# EAGLE design 1A_driver (EAGLE 7.7.0)
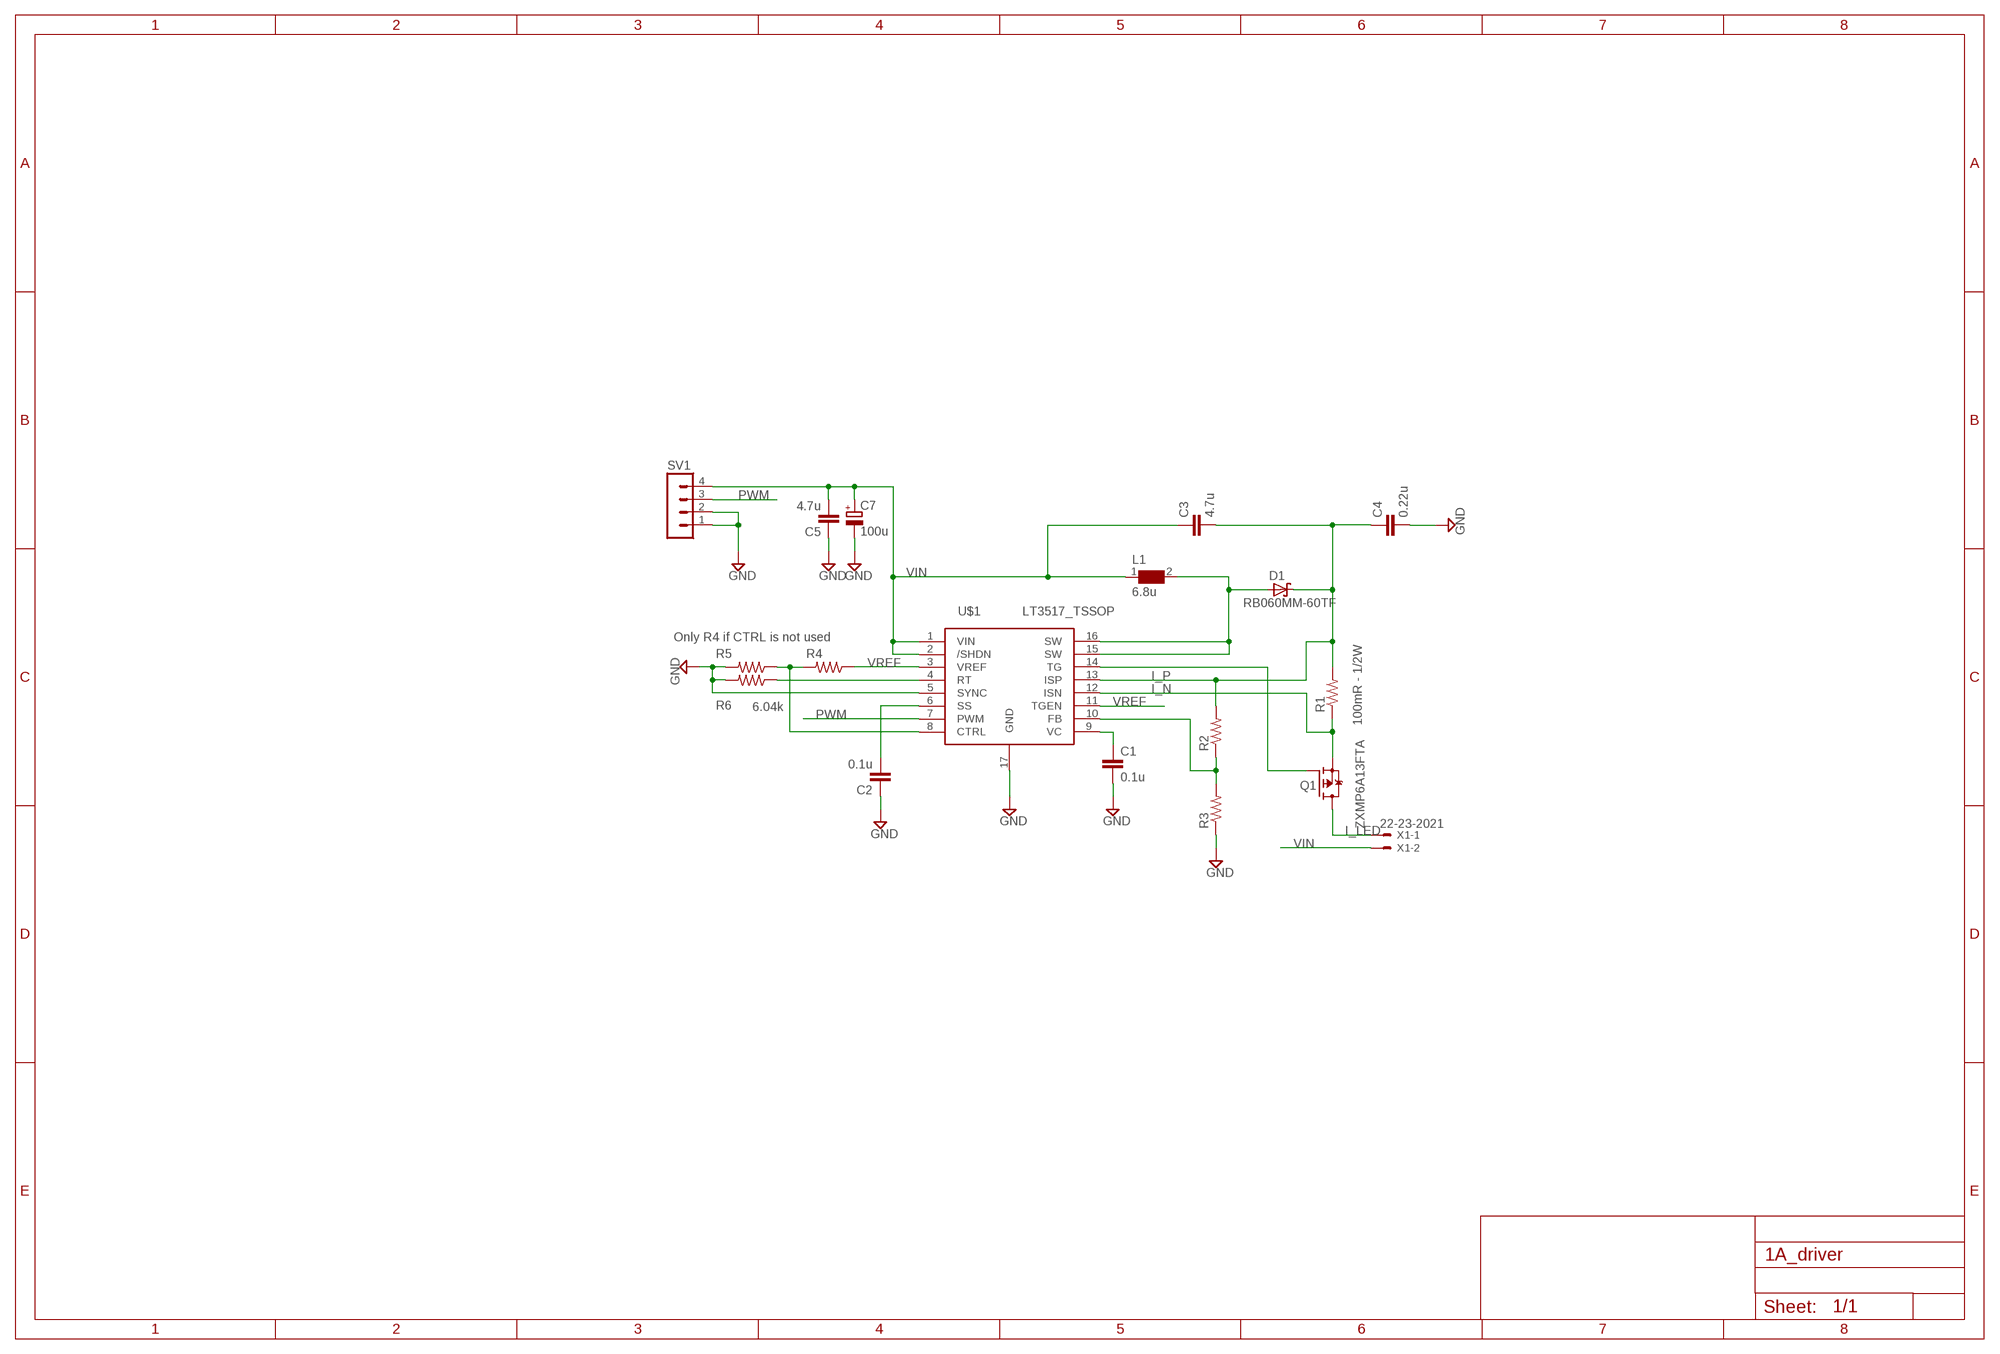
[diagram p0: schematic, sheet 1]

## Parts
C1  0.1u  CAP_0603  [R0603]
C2  0.1u  CAP_0603  [R0603]
C3  4.7u  CAP_1206  [R1206]
C4  0.22u  CAP_0603  [R0603]
C5  4.7u  CAP_1206  [R1206]
C7  100u  CPOL-EUE5-5  [E5-5]
D1  RB060MM-60TF  SCH_DIODE  [SOD123FL]
L1  6.8u  WE-PD-744771006_1260/1245/1280/1210  [WE-PD_1260/1245/1280/1210]
Q1  ZXMP6A13FTA  P-CHAN_MOSFET  [SOT23]
R1  100mR - 1/2W  RES_1206  [R1206]
R2  RES_0603  [R0603]
R3  RES_0603  [R0603]
R4  RES_0603  [R0603]
R5  RES_0603  [R0603]
R6  6.04k  RES_0603  [R0603]
SV1  MA04-1  [MA04-1]
U$1  LT3517_TSSOP  [TSSOP16_PAD]
X1  22-23-2021  [22-23-2021]

## Nets
GND: C1.2 C2.1 C4.2 C5.1 C7.- R3.1 R5.2 R6.2 SV1.1 SV1.2 U$1.5(SYNC) U$1.17(GND)
I_LED: Q1.D X1.1
I_N: Q1.S R1.1 U$1.12(ISN)
I_P: C3.2 C4.1 D1.C R1.2 R2.2 U$1.13(ISP)
N$3: Q1.G U$1.14(TG)
N$4: D1.A L1.2 U$1.15(SW) U$1.16(SW)
N$6: R2.1 R3.2 U$1.10(FB)
N$8: C2.2 U$1.6(SS)
N$9: R4.2 R5.1 U$1.8(CTRL)
N$10: C1.1 U$1.9(VC)
N$11: R6.1 U$1.4(RT)
PWM: SV1.3 U$1.7(PWM)
VIN: C3.1 C5.2 C7.+ L1.1 SV1.4 U$1.1(VIN) U$1.2(/SHDN) X1.2
VREF: R4.1 U$1.3(VREF) U$1.11(TGEN)

## Notes on the sheet
- Only R4 if CTRL is not used

## Library data of the parts
C1 C2 C4 = standard_passive:CAP_0603
C3 C5 = standard_passive:CAP_1206
C7 = rcl:CPOL-EU: POLARIZED CAPACITOR, European symbol
D1 = DIODES:SCH_DIODE
L1 = WE-PD:WE-PD: SMD-Shielded Power Inductors WE-PD - Magnetically shielded version which results in a low leakage field - High storage capacity - Low self-losses - Highest possible current loading for SMD-Inducors -- Switching regulators with low operating voltages (computer, laptop, mobile phones, pagers) -- Integrated DC/DC-converter -- Is recommended for the application with switching regulators from National Semiconductor, Linear Technology, Texas Instruments and Fairchild Semiconductor, ect. -- Graphic cards -- Plastic base: Because of the one piece construction these are more suitable for high vibration or shock applications; MPN: 744771006; OC_FARNELL: 2211534; OC_NEWARK: 44W4713; PACKAGE: 1260; SUPPLIER: Wuerth Elektronik
Q1 = MOSFET:P-CHAN_MOSFET
R1 = standard_passive:RES_1206
R2-R6 = standard_passive:RES_0603
SV1 = con-lstb:MA04-1: PIN HEADER; OC_FARNELL: unknown; OC_NEWARK: unknown
U$1 = LT3517:LT3517_TSSOP
X1 = con-molex:22-23-2021: .100" (2.54mm) Center Header - 2 Pin; MF: MOLEX; MPN: 22-23-2021; OC_FARNELL: 1462926; OC_NEWARK: 25C3832

## Board
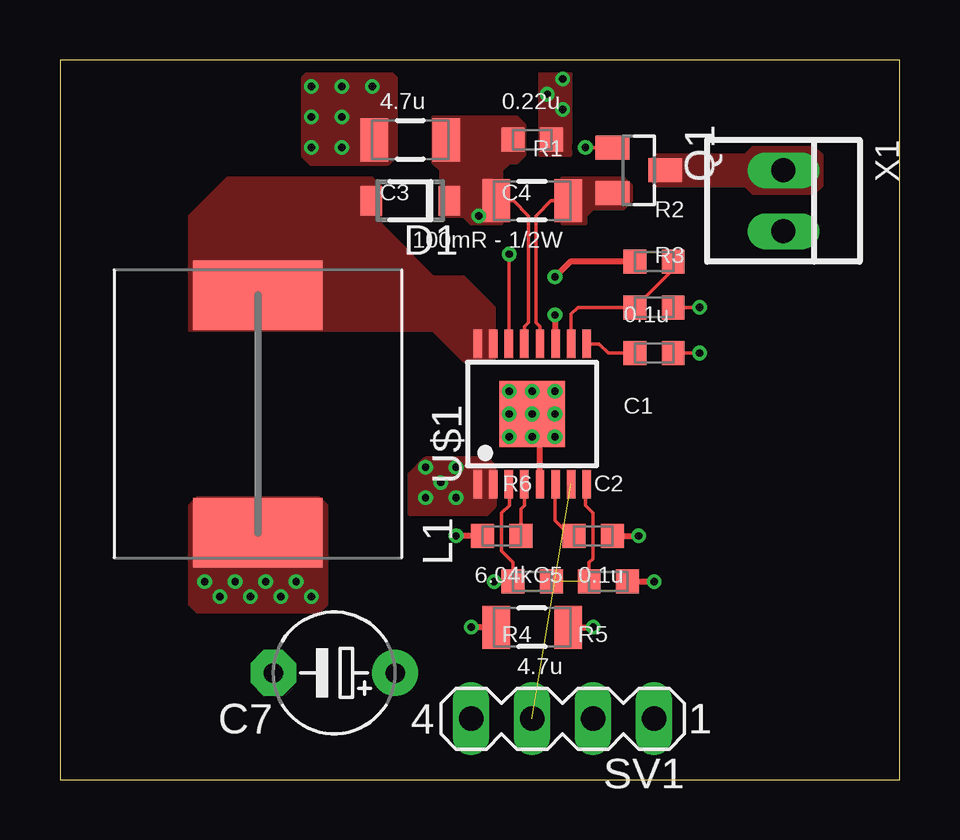
[diagram p1: board, top side]
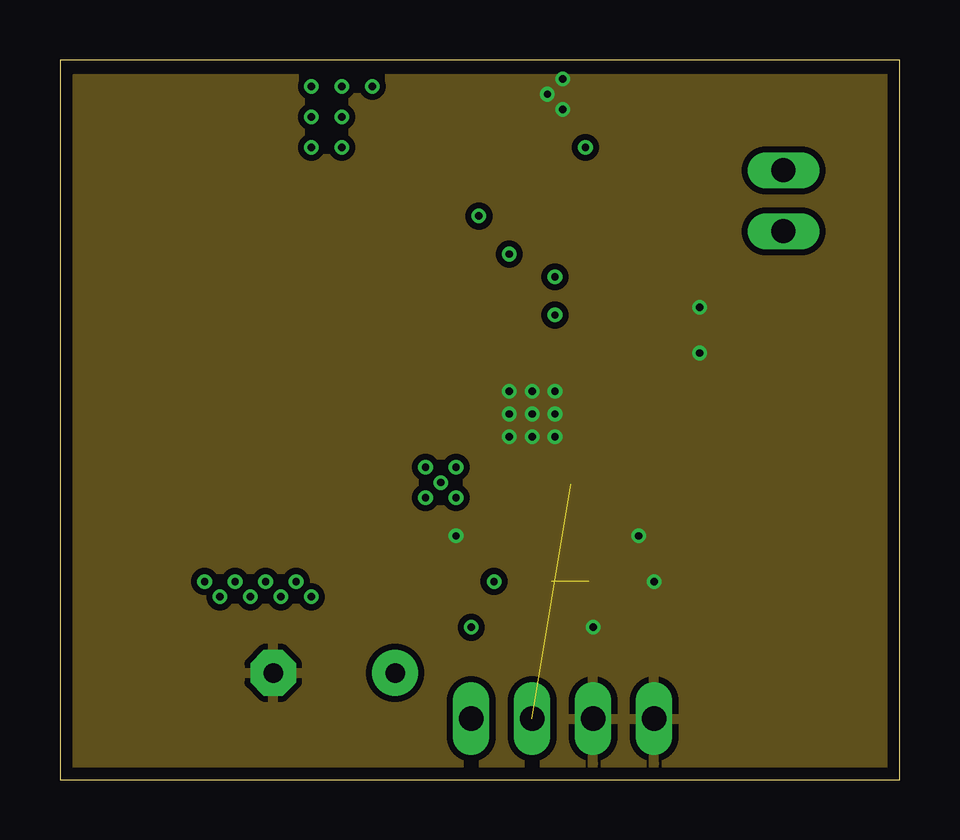
[diagram p2: board, inner layer Route2]
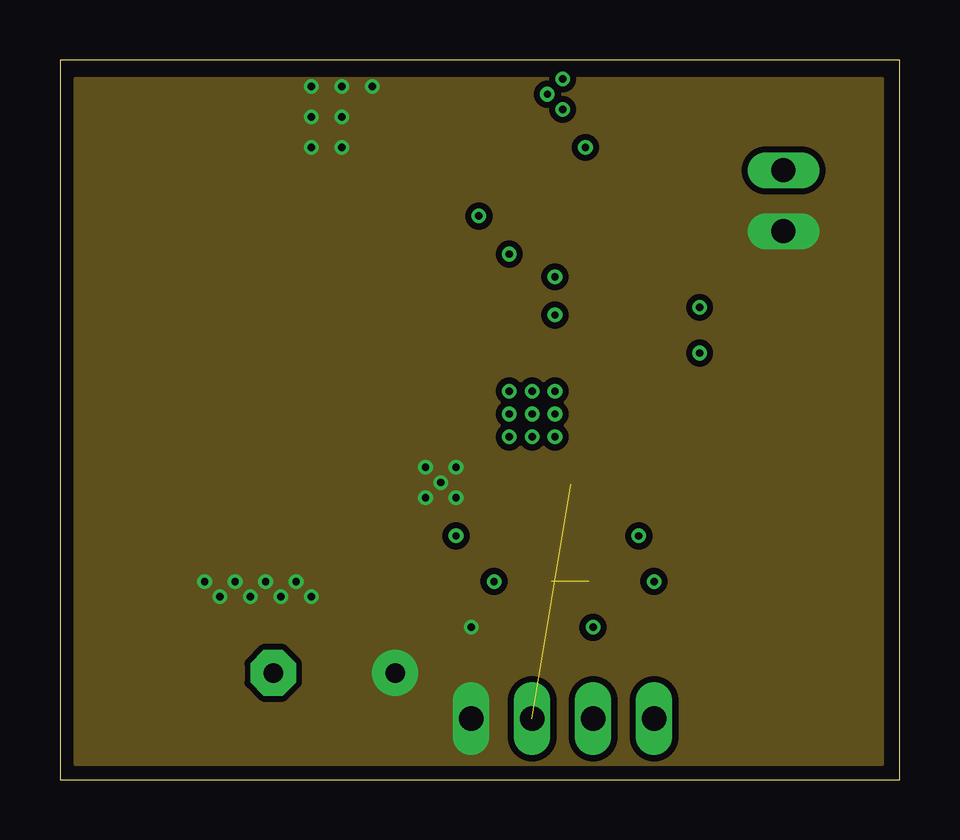
[diagram p3: board, inner layer Route15]
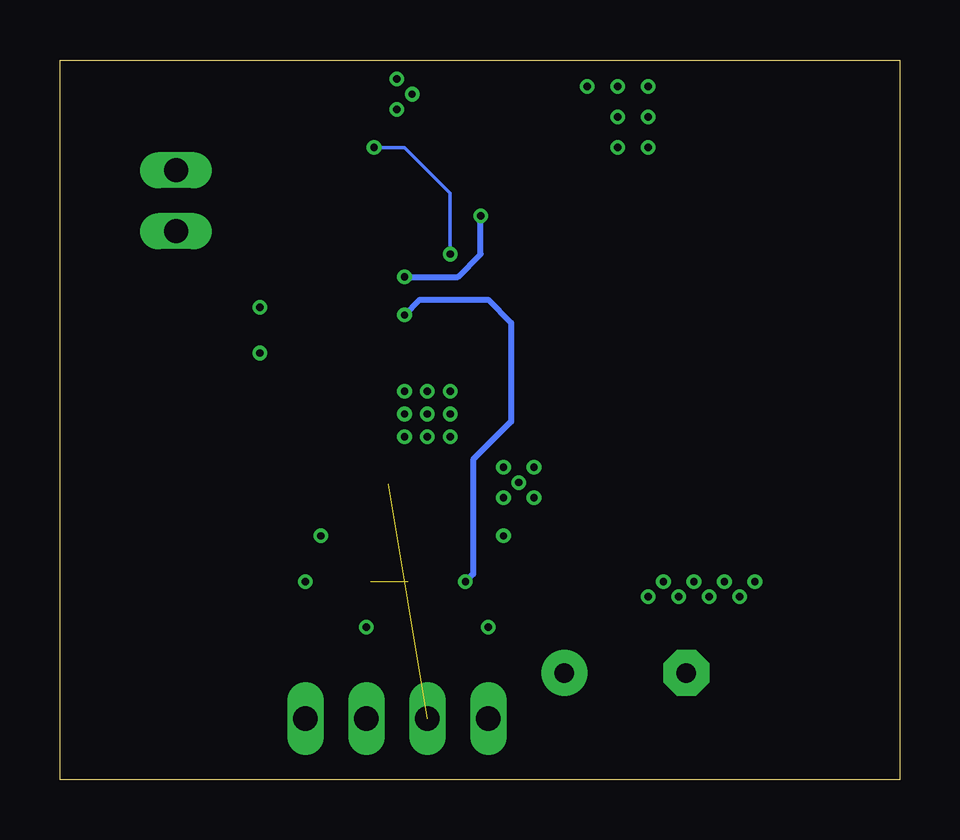
[diagram p4: board, bottom side, seen from below]

Size 35 x 30 mm. Coordinates in mm from the lower left corner, seen from the top.
Outline: 0,0 35,0 35,30 0,30 0,0
Copper layers (1*2*15*16): Top 0.035mm / dielectric 0.2mm / Route2 0.035mm / dielectric 1.2mm / Route15 0.035mm / dielectric 0.2mm / Bottom 0.035mm
Design rules "Elecrow_4-layer_PCB_eagle_rule": minimum track width 6mil, minimum drill 12mil, track to track 6mil, track to pad 6mil, pad to pad 6mil, via to via 8mil, smd to smd 0mil, copper to edge 20mil, drill to drill 10mil, minimum pad ring 6mil, minimum via ring 6mil, stop-mask expansion 0mil, vias tented up to drill 100mil, thermal gap 10mil

### Footprints (pad centres in the part's own frame; a part is rotated, then mirrored left to right if it is on the bottom)
R0603 = smd 0.95 x 1: 1 -0.8,0; 2 0.8,0
R1206 = smd 1.15 x 1.8: 1 -1.5,0; 2 1.5,0
E5-5 = drill 0.813 pad 1.905: + -2.54,0 | drill 0.813 pad 1.905 octagon: - 2.54,0
SOD123FL = smd 0.91 x 1.22: A 1.625,0; C -1.625,0
WE-PD_1260/1245/1280/1210 = smd 2.9 x 5.4: 1 -4.95,0; 2 4.95,0
SOT23 = smd 1 x 1.4: D 0,1.1; G -0.95,-1.1; S 0.95,-1.1
MA04-1 = drill 1.016 long: 1 -3.81,0; 2 -1.27,0; 3 1.27,0; 4 3.81,0
TSSOP16_PAD = smd 0.35 x 1.2: 1 -2.275,-2.925; 2 -1.625,-2.925; 3 -0.975,-2.925; 4 -0.325,-2.925; 5 0.325,-2.925; 6 0.975,-2.925; 7 1.625,-2.925; 8 2.275,-2.925; 9 2.275,2.925; 10 1.625,2.925; 11 0.975,2.925; 12 0.325,2.925; 13 -0.325,2.925; 14 -0.975,2.925; 15 -1.625,2.925; 16 -2.275,2.925 | smd 2.74 x 2.74: 17 0,0
22-23-2021 = drill 1 long: 1 -1.27,0; 2 1.27,0

### Placement (x,y rotation side)
C1  24.77,17.78 0 top
C2  22.23,10.16 180 top
C3  14.61,26.67 0 top
C4  19.68,26.67 0 top
C5  19.68,6.35 180 top
C7  11.43,4.45 180 top
D1  14.61,24.13 180 top
L1  8.26,15.24 90 top
Q1  24.13,25.4 270 top
R1  19.68,24.13 180 top
R2  24.77,21.59 180 top
R3  24.77,19.68 180 top
R4  19.68,8.26 0 top
R5  22.86,8.26 0 top
R6  18.41,10.16 180 top
SV1  20.95,2.54 180 top
U$1  19.68,15.24 0 top
X1  30.16,24.13 270 top

### Tracks (layer width: path | path; a pad name or v marks a point on that pad's centre or on a via)
GND  (via drill 0.3, 0.3 pad 0.61)
  Top 0.152: R3.1 v26.67,19.68 | C1.2 v26.67,17.78
  Top 0.254: U$1.5 20.01,13.96 v19.68,14.29 | C2.1 v24.13,10.16 | R6.2 v16.51,10.16 | R5.2 v24.77,8.26 | C5.1 v22.23,6.35
  other vias: 19.68,15.24 18.73,16.19 19.68,16.19 20.64,16.19 20.64,15.24 20.64,14.29 18.73,14.29 18.73,15.24 20.95,29.21 20.32,28.57 20.95,27.94
  pour Route2: 0.64,29.21 39.37,29.21 39.37,13.34 39.37,0.64 0.64,0.64
  pour Top (no thermals): 20,26.04 20,29.53 21.27,29.53 21.27,26.04
I_LED
  pour Top (no thermals): 24.77,26.04 28.57,26.04 28.89,26.35 31.43,26.35 31.75,26.04 31.75,25.08 31.75,24.77 31.43,24.45 28.89,24.45 28.57,24.77 24.77,24.77
I_N
  Top 0.152: U$1.12 20.01,18.88 19.84,19.05 19.84,23.5 20.47,24.13 R1.1
  pour Top (no thermals): 20.95,25.08 23.5,25.08 23.81,24.77 23.81,24.13 23.5,23.81 22.23,23.81 21.91,23.5 21.91,23.18 20.95,23.18
I_P  (via drill 0.3 pad 0.61)
  Top 0.152: U$1.13 19.36,18.88 19.53,19.05 19.53,23.5 18.9,24.13 R1.2
  Top 0.254: R2.2 21.27,21.59 v20.64,20.95
  Bottom 0.254: v20.64,20.95 18.41,20.95 17.46,21.91 v17.46,23.5
  pour Top (no thermals): 15.88,24.77 16.83,24.77 17.14,25.08 18.41,25.08 18.41,23.18 17.14,23.18 16.83,23.5 15.88,23.5
  pour Top (no thermals): 15.88,23.5 15.88,25.4 15.56,25.72 15.56,27.62 19.05,27.62 19.37,27.3 19.37,26.04 19.05,25.72 18.73,25.72 18.41,25.4 18.41,23.18 17.14,23.18 16.83,23.5
N$3  (via drill 0.3 pad 0.61)
  Top 0.152: U$1.14 18.71,21.89 v18.73,21.91 | v21.91,26.35 Q1.G
  Bottom 0.152: v18.73,21.91 18.73,24.45 20.64,26.35 v21.91,26.35
N$4
  pour Top (no thermals): 5.4,18.73 15.56,18.73 16.83,17.46 18.1,17.46 18.1,19.68 16.83,20.95 15.56,20.95 13.34,23.18 13.34,24.77 13.02,25.08 6.99,25.08 5.4,23.5
N$6
  Top 0.152: U$1.10 21.31,19.41 21.59,19.68 R3.2 25.57,21.29 R2.1
N$8
  Top 0.152: C2.2 21.27,10.16 20.64,10.79 20.64,12.29 U$1.6
N$9  (1 unrouted)
  Top 0.152: R5.1 22.06,9.04 22.23,9.21 22.23,11.11 21.91,11.43 21.91,12.26 U$1.8
N$10
  Top 0.152: U$1.9 22.48,18.16 22.86,17.78 C1.1
N$11
  Top 0.152: R6.1 19.21,11.28 19.37,11.43 19.37,12.31 U$1.4
PWM  (1 unrouted)
VIN  (via drill 0.3 pad 0.61)
  Top 0.254: C5.2 v17.14,6.35
  other vias: 6.03,8.26 6.67,7.62 7.3,8.26 7.94,7.62 8.57,8.26 9.21,7.62 9.84,8.26 10.48,7.62 10.48,28.89 11.75,28.89 13.02,28.89 10.48,27.62 11.75,27.62 10.48,26.35 11.75,26.35 15.24,13.02 15.24,11.75 15.88,12.38 16.51,13.02 16.51,11.75
  pour Route15 (no thermals): 18.1,0.64 34.29,0.64 34.29,29.21 0.64,29.21 0.64,0.64
  pour Top (no thermals): 5.4,8.57 5.4,11.43 5.71,11.75 10.79,11.75 11.11,11.43 11.11,7.62 11.11,7.3 10.79,6.99 5.71,6.99 5.4,7.3
  pour Top (no thermals): 10.48,25.72 13.65,25.72 13.97,26.04 13.97,29.21 13.65,29.53 10.48,29.53 10.16,29.21 10.16,26.04
  pour Top (no thermals): 18.1,11.43 18.1,13.02 17.78,13.34 15.24,13.34 14.61,12.7 14.61,11.11 17.78,11.11
VREF  (via drill 0.3 pad 0.61)
  Top 0.152: R4.1 18.89,9.05 18.41,9.53 18.41,11.11 18.73,11.43 18.73,12.29 U$1.3
  Top 0.254: U$1.11 20.66,19.34 v20.64,19.37 | R4.1 v18.1,8.26
  Bottom 0.254: v20.64,19.37 20,20 17.14,20 16.19,19.05 16.19,14.92 17.78,13.34 17.78,8.57 v18.1,8.26